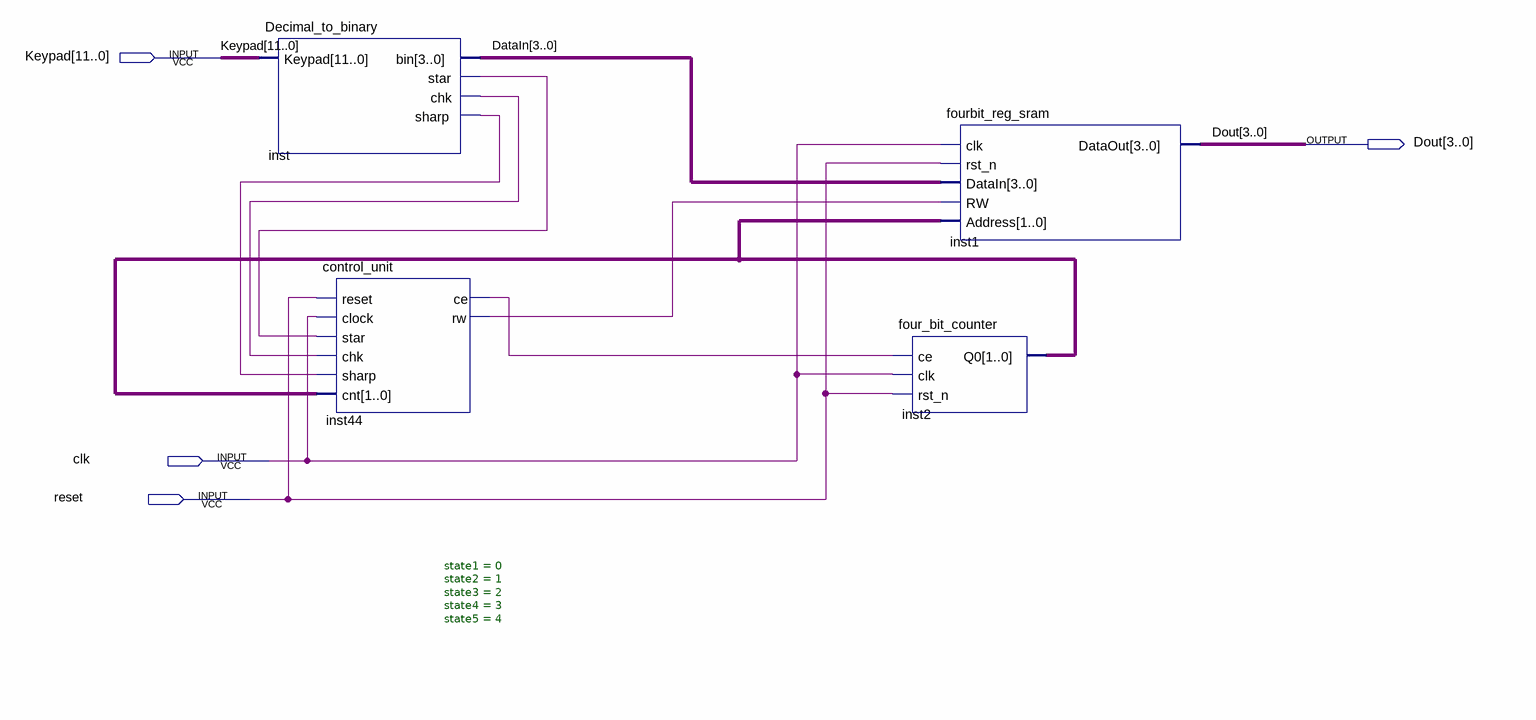
[diagram p0: schematic sheet]
// Quartus schematic practice2.bdf as structural Verilog: 4 symbols, 4 pins
module practice2 (
  input  [11:0] Keypad,
  input  clk,
  input  reset,
  output [3:0] Dout
);

  wire inst44_ce, inst44_rw, inst_chk, inst_sharp, inst_star;
  wire [1:0] inst2_q0;
  wire [3:0] DataIn;

  Decimal_to_binary inst (.Keypad(Keypad), .bin(DataIn), .star(inst_star), .chk(inst_chk), .sharp(inst_sharp));
  control_unit #(.state1(0), .state2(1), .state3(2), .state4(3), .state5(4)) inst44 (
    .reset(reset), .clock(clk), .star(inst_star), .chk(inst_chk), .sharp(inst_sharp), .cnt(inst2_q0),
    .ce(inst44_ce), .rw(inst44_rw));
  fourbit_reg_sram inst1 (
    .clk(clk), .rst_n(reset), .DataIn(DataIn), .RW(inst44_rw), .Address(inst2_q0), .DataOut(Dout));
  four_bit_counter inst2 (.ce(inst44_ce), .clk(clk), .rst_n(reset), .Q0(inst2_q0));
endmodule
